# Altium schematic sheet MODELS.SchDoc
size A4
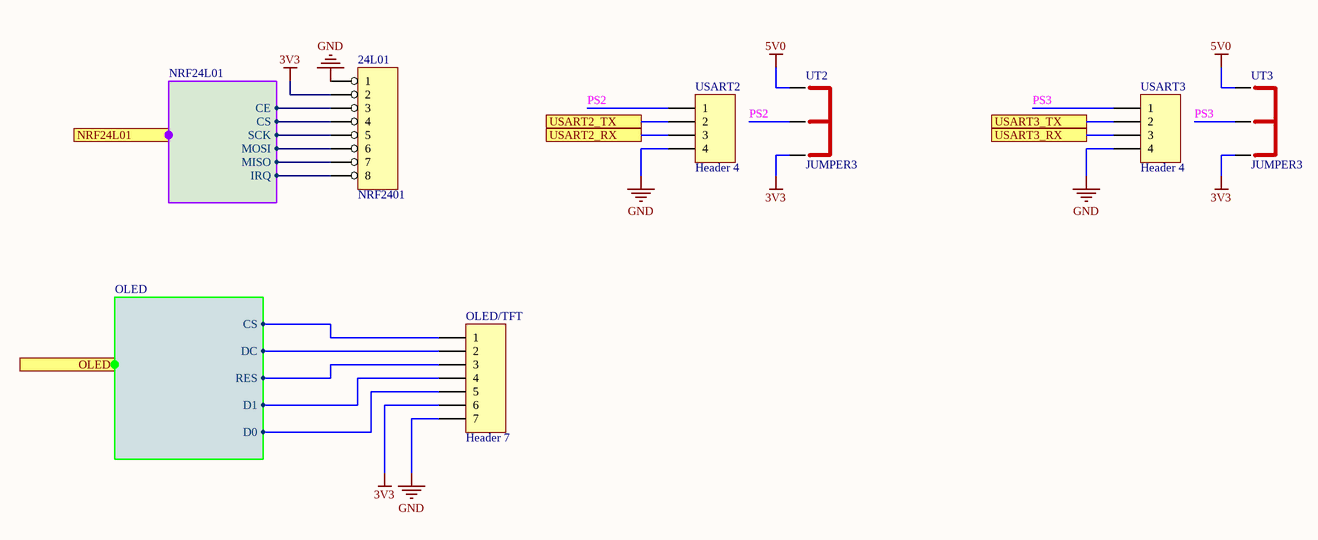
[diagram p0: MODELS.SchDoc]

## Parts
24L01  NRF2401  [HDR2X4]
OLED/TFT  Header 7  [HDR1X7]
USART2  Header 4  [HDR1X4]
USART3  Header 4  [HDR1X4]
UT2  JUMPER3  [Jumper3]
UT3  JUMPER3  [Jumper3]

## Ports
NRF24L01 (harness NRF24L01), OLED (harness OLED), USART2_RX, USART2_TX, USART3_RX, USART3_TX

## Harnesses
NRF24L01: CE, CS, SCK, MOSI, MISO, IRQ
OLED: D0, D1, RES, DC, CS

## Nets
3V3: 24L01.2 OLED/TFT.6 UT2.3 UT3.3
5V0: UT2.1 UT3.1
GND: 24L01.1 OLED/TFT.7 USART2.4 USART3.4
PS2: USART2.1 UT2.2
PS3: USART3.1 UT3.2
USART2_RX: USART2.3 ; port USART2_RX
USART2_TX: USART2.2 ; port USART2_TX
USART3_RX: USART3.3 ; port USART3_RX
USART3_TX: USART3.2 ; port USART3_TX
Net24L01_3: 24L01.3 ; port NRF24L01.CE
Net24L01_4: 24L01.4 ; port NRF24L01.CS
Net24L01_5: 24L01.5 ; port NRF24L01.SCK
Net24L01_6: 24L01.6 ; port NRF24L01.MOSI
Net24L01_7: 24L01.7 ; port NRF24L01.MISO
Net24L01_8: 24L01.8 ; port NRF24L01.IRQ
NetOLED/TFT_1: OLED/TFT.1 ; port OLED.CS
NetOLED/TFT_2: OLED/TFT.2 ; port OLED.DC
NetOLED/TFT_3: OLED/TFT.3 ; port OLED.RES
NetOLED/TFT_4: OLED/TFT.4 ; port OLED.D1
NetOLED/TFT_5: OLED/TFT.5 ; port OLED.D0

## Library data of the parts
24L01 = HEADER 8: 8 Pin Header
OLED/TFT = Header 7: Header, 7-Pin; LatestRevisionDate: 17-Jul-2002; LatestRevisionNote: Re-released for DXP Platform.; Publisher: Altium Limited
USART2 USART3 = Header 4: Header, 4-Pin; LatestRevisionDate: 17-Jul-2002; LatestRevisionNote: Re-released for DXP Platform.; Publisher: Altium Limited
UT2 UT3 = JUMPER3: Jumper